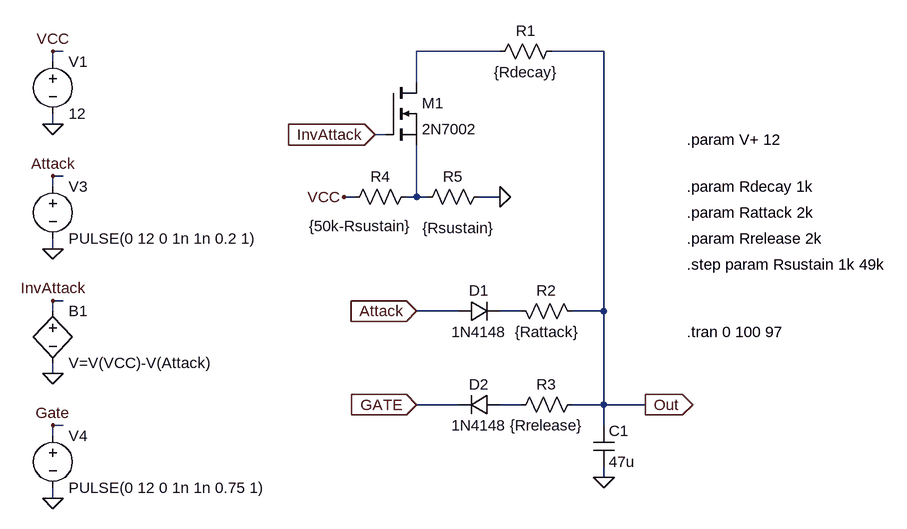
[diagram p0: schematic EG_Analog2_0_analog_mosfet.asc]
EG_Analog2_0_analog_mosfet.asc, the LTspice schematic file:
Version 4
SHEET 1 1508 724
WIRE -16 -304 -32 -304
WIRE 656 -304 528 -304
WIRE 816 -304 736 -304
WIRE -32 -288 -32 -304
WIRE 528 -256 528 -304
WIRE -32 -192 -32 -208
WIRE 480 -176 464 -176
WIRE -16 -112 -32 -112
WIRE -32 -96 -32 -112
WIRE 432 -80 416 -80
WIRE 528 -80 528 -160
WIRE 528 -80 512 -80
WIRE 544 -80 528 -80
WIRE 656 -80 624 -80
WIRE -32 0 -32 -16
WIRE -16 80 -32 80
WIRE -32 96 -32 80
WIRE 592 96 528 96
WIRE 688 96 656 96
WIRE 816 96 816 -304
WIRE 816 96 768 96
WIRE -32 192 -32 176
WIRE 592 240 528 240
WIRE 688 240 656 240
WIRE 816 240 816 96
WIRE 816 240 768 240
WIRE 880 240 816 240
WIRE -16 272 -32 272
WIRE 816 272 816 240
WIRE -32 288 -32 272
WIRE 816 352 816 336
WIRE -32 384 -32 368
FLAG 464 -176 InvAttack
IOPIN 464 -176 In
FLAG 528 96 Attack
IOPIN 528 96 In
FLAG 528 240 GATE
IOPIN 528 240 In
FLAG 816 352 0
FLAG 880 240 Out
IOPIN 880 240 Out
FLAG -32 -192 0
FLAG -32 192 0
FLAG -32 -304 VCC
FLAG -32 80 InvAttack
FLAG -32 -112 Attack
FLAG -32 0 0
FLAG -32 384 0
FLAG -32 272 Gate
FLAG 416 -80 VCC
FLAG 656 -80 0
SYMBOL res 752 -320 R90
WINDOW 0 0 56 VBottom 2
WINDOW 3 32 56 VTop 2
SYMATTR InstName R1
SYMATTR Value {Rdecay}
SYMBOL diode 592 112 R270
WINDOW 0 32 32 VTop 2
WINDOW 3 0 32 VBottom 2
SYMATTR InstName D1
SYMATTR Value 1N4148
SYMBOL res 672 80 M90
WINDOW 0 0 56 VBottom 2
WINDOW 3 32 56 VTop 2
SYMATTR InstName R2
SYMATTR Value {Rattack}
SYMBOL diode 656 224 R90
WINDOW 0 0 32 VBottom 2
WINDOW 3 32 32 VTop 2
SYMATTR InstName D2
SYMATTR Value 1N4148
SYMBOL res 784 224 R90
WINDOW 0 0 56 VBottom 2
WINDOW 3 32 56 VTop 2
SYMATTR InstName R3
SYMATTR Value {Rrelease}
SYMBOL cap 800 272 R0
SYMATTR InstName C1
SYMATTR Value 47u
SYMBOL voltage -32 -304 R0
WINDOW 123 0 0 Left 2
WINDOW 39 0 0 Left 2
SYMATTR InstName V1
SYMATTR Value 12
SYMBOL voltage -32 -112 R0
WINDOW 123 0 0 Left 2
WINDOW 39 0 0 Left 2
SYMATTR InstName V3
SYMATTR Value PULSE(0 12 0 1n 1n 0.2 1)
SYMBOL voltage -32 272 R0
WINDOW 123 0 0 Left 2
WINDOW 39 0 0 Left 2
SYMATTR InstName V4
SYMATTR Value PULSE(0 12 0 1n 1n 0.75 1)
SYMBOL res 416 -64 R270
WINDOW 0 32 56 VTop 2
WINDOW 3 -13 25 VBottom 2
SYMATTR InstName R4
SYMATTR Value {50k-Rsustain}
SYMBOL res 528 -64 R270
WINDOW 0 32 56 VTop 2
WINDOW 3 -16 64 VBottom 2
SYMATTR InstName R5
SYMATTR Value {Rsustain}
SYMBOL bv -32 80 R0
SYMATTR InstName B1
SYMATTR Value V=V(VCC)-V(Attack)
SYMBOL nmos 480 -256 R0
SYMATTR InstName M1
SYMATTR Value 2N7002
TEXT 944 -96 Left 2 !.param Rdecay 1k
TEXT 944 -56 Left 2 !.param Rattack 2k
TEXT 944 -16 Left 2 !.param Rrelease 2k
TEXT 944 128 Left 2 !.tran 0 100 97
TEXT 944 24 Left 2 !.step param Rsustain 1k 49k
TEXT 944 -168 Left 2 !.param V+ 12

The netlist it stands for:
* EG_Analog2_0_analog_mosfet.asc
R1 Out N001 {Rdecay}
D1 Attack N003 1N4148
R2 N003 Out {Rattack}
D2 N004 GATE 1N4148
R3 Out N004 {Rrelease}
C1 Out 0 47u
V1 VCC 0 12
V3 Attack 0 PULSE(0 12 0 1n 1n 0.2 1)
V4 GATE 0 PULSE(0 12 0 1n 1n 0.75 1)
R4 VCC N002 {50k-Rsustain}
R5 N002 0 {Rsustain}
B1 InvAttack 0 V=V(VCC)-V(Attack)
M1 N001 InvAttack N002 N002 2N7002
.model D D
.lib standard.dio
.model NMOS NMOS
.model PMOS PMOS
.lib standard.mos
.param Rdecay 1k
.param Rattack 2k
.param Rrelease 2k
.tran 0 100 97
.step param Rsustain 1k 49k
.param V+ 12
.backanno
.end